# EAGLE design untitled (EAGLE 9.6.1)
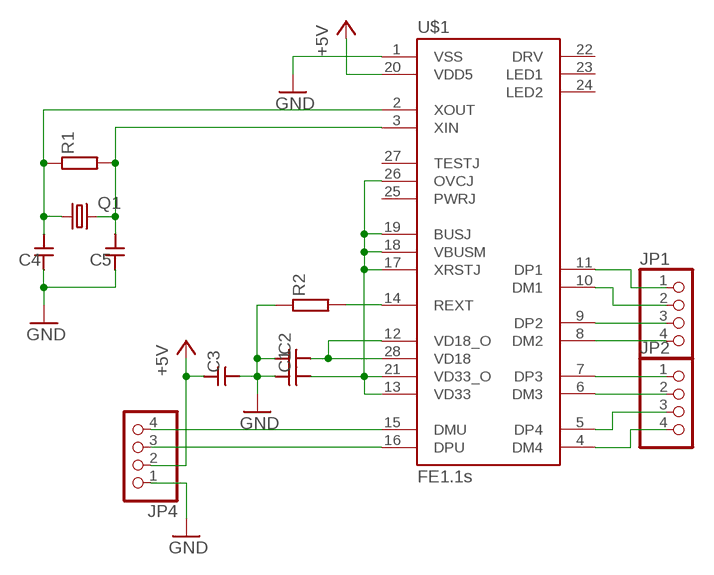
[diagram p0: schematic, sheet 1]

## Parts
C1  CAPACITOR1608  [SMD1608]
C2  CAPACITOR1608  [SMD1608]
C3  CAPACITOR1608  [SMD1608]
C4  CAPACITOR1608  [SMD1608]
C5  CAPACITOR1608  [SMD1608]
JP1  PINHD-1X4  [1X04]
JP2  PINHD-1X4  [1X04]
JP4  PINHD-1X4  [1X04]
Q1  CRYSTALHC49S  [HC49/S]
R1  RESISTOR1608  [SMD1608]
R2  RESISTOR1608  [SMD1608]
U$1  FE1.1S  [FE1.1S_SSOP-28]

## Nets
+5V: C3.1 JP4.2 U$1.20(VDD5)
GND: C1.1 C2.1 C3.2 C4.1 C5.1 JP4.1 R2.1 U$1.1(VSS)
N$1: JP4.4 U$1.15(DMU)
N$2: R2.2 U$1.14(REXT)
N$3: C2.2 U$1.12(VD18_O) U$1.28(VD18)
N$4: C4.2 Q1.1 R1.1 U$1.2(XOUT)
N$5: C1.2 U$1.13(VD33) U$1.17(XRSTJ) U$1.18(VBUSM) U$1.19(BUSJ) U$1.21(VD33_O) U$1.26(OVCJ)
N$6: C5.2 Q1.2 R1.2 U$1.3(XIN)
N$7: JP4.3 U$1.16(DPU)
N$10: JP1.4 U$1.8(DM2)
N$11: JP2.1 U$1.7(DP3)
N$12: JP2.2 U$1.6(DM3)
N$13: JP2.3 U$1.5(DP4)
N$14: JP2.4 U$1.4(DM4)
N$15: JP1.3 U$1.9(DP2)
N$16: JP1.2 U$1.10(DM1)
N$17: JP1.1 U$1.11(DP1)
Unconnected: U$1.22(DRV) U$1.23(LED1) U$1.24(LED2) U$1.25(PWRJ) U$1.27(TESTJ)

## Library data of the parts
C1-C5 = generic:CAPACITOR: Generic Capacitor
JP1 JP2 JP4 = pinhead:PINHD-1X4: PIN HEADER
Q1 = crystal:CRYSTAL: CRYSTAL; OC_FARNELL: 1667008; OC_NEWARK: unknown
R1 R2 = generic:RESISTOR: Generic Registor
U$1 = imcom:FE1.1S: A USB 2.0 hub IC. http://www.jfd-ic.com/Documents/FE1.1s%20Data%20Sheet%20%28Rev.%201.0%29.pdf

## Board
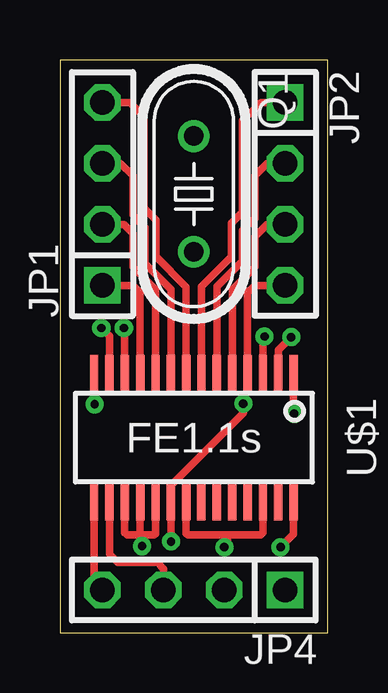
[diagram p1: board, top side]
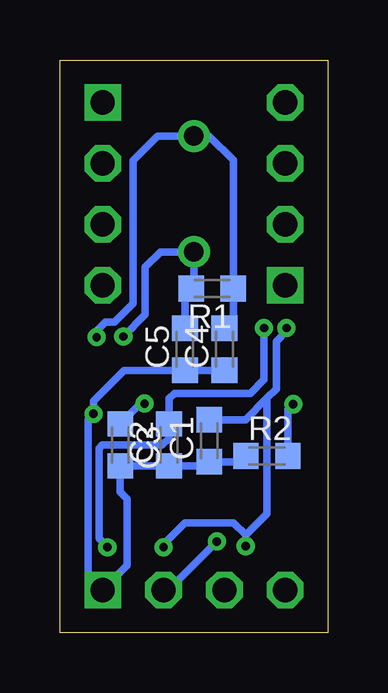
[diagram p2: board, bottom side, seen from below]

Size 11.18 x 23.88 mm. Coordinates in mm from the lower left corner, seen from the top.
Outline: 0,0 11.18,0 11.18,23.88 0,23.88 0,0
Copper layers (1*16): Top 0.035mm / dielectric 1.5mm / Bottom 0.035mm
Design rules "default": minimum track width 6mil, minimum drill 0.35mm, track to track 6mil, track to pad 6mil, pad to pad 6mil, via to via 6mil, smd to smd 6mil, copper to edge 40mil, drill to drill 6mil, minimum pad ring 10mil, minimum via ring 8mil, stop-mask expansion 4mil, vias tented up to drill 0mil, thermal gap 10mil

### Footprints (pad centres in the part's own frame; a part is rotated, then mirrored left to right if it is on the bottom)
SMD1608 = smd 1.05 x 1.08: 1 -0.875,0; 2 0.875,0
1X04 = drill 1.016 square: 1 -3.81,0 | drill 1.016 octagon: 2 -1.27,0; 3 1.27,0; 4 3.81,0
HC49/S = drill 0.813: 1 -2.413,0; 2 2.413,0
FE1.1S_SSOP-28 = smd 0.35 x 1.5: 1 -4.16,-2.7; 2 -3.52,-2.7; 3 -2.88,-2.7; 4 -2.24,-2.7; 5 -1.6,-2.7; 6 -0.96,-2.7; 7 -0.32,-2.7; 8 0.32,-2.7; 9 0.96,-2.7; 10 1.6,-2.7; 11 2.24,-2.7; 12 2.88,-2.7; 13 3.52,-2.7; 14 4.16,-2.7; 15 4.16,2.7; 16 3.52,2.7; 17 2.88,2.7; 18 2.24,2.7; 19 1.6,2.7; 20 0.96,2.7; 21 0.32,2.7; 22 -0.3,2.7; 23 -0.96,2.7; 24 -1.6,2.7; 25 -2.24,2.7; 26 -2.88,2.7; 27 -3.52,2.7; 28 -4.16,2.7

### Placement (x,y rotation side)
C1  4.95,8 90 bottom
C2  6.63,7.82 90 bottom
C3  8.66,7.82 270 bottom
C4  4.32,11.81 90 bottom
C5  5.97,11.81 90 bottom
JP1  1.78,18.29 90 top
JP2  9.4,18.29 270 top
JP4  5.59,1.78 180 top
Q1  5.59,18.29 270 top
R1  4.83,14.35 180 bottom
R2  2.54,7.37 0 bottom
U$1  5.59,8.13 180 top

### Tracks (layer width: path | path; a pad name or v marks a point on that pad's centre or on a via)
+5V  (via drill 0.35, 0.35 pad 0.65)
  Top 0.305: v4.64,3.8 4.63,3.8 U$1.20 4.63,6.14 7.65,9.16 v7.65,9.55
  Bottom 0.305: v4.64,3.8 6.65,1.78 JP4.2 | C3.1 7.81,9.55 v7.65,9.55
GND  (via drill 0.35)
  Top 0.305: U$1.1 9.75,9.15 v9.78,9.12
  Bottom 0.305: C4.1 C5.1 8.49,10.94 9.78,9.65 v9.78,9.12 10.01,8.88 10.01,2.39 JP4.1 8.38,2.79 8.38,5.58 8.66,5.86 C3.2 C2.1 5.13,6.95 C1.1 3.94,7.13 R2.1
N$1
  Top 0.305: U$1.15 1.43,2.13 JP4.4
N$2  (via drill 0.35)
  Top 0.305: U$1.14 1.45,10.81 v1.45,9.53
  Bottom 0.305: v1.45,9.53 1.67,9.31 R2.2
N$3  (via drill 0.35)
  Top 0.305: U$1.12 2.71,12.66 v2.67,12.7 | U$1.28 9.75,4.1 v9.2,3.56
  Bottom 0.305: v2.67,12.7 2.67,10.55 3.24,9.98 6.4,9.98 6.63,9.75 C2.2 6.63,8.1 6.91,7.82 9.41,7.82 9.56,7.68 9.56,3.92 v9.2,3.56
N$4  (via drill 0.35)
  Top 0.305: U$1.2 9.11,11.78 v9.65,12.32
  Bottom 0.305: v9.65,12.32 9.65,12.57 9.27,12.95 8.89,12.95 8.13,13.72 8.13,19.68 7.11,20.7 Q1.1 4.95,20.7 3.95,19.7 R1.1 3.95,13.05 C4.2
N$5  (via drill 0.35)
  Top 0.305: U$1.17 2.71,4.15 2.79,4.06 3.35,4.06 | U$1.26 8.47,4.15 8.38,4.06 6.99,4.06 | U$1.18 3.35,4.06 | U$1.13 2.07,12.36 v1.73,12.7 | U$1.19 3.99,4.12 3.94,4.06 3.35,4.06 | U$1.21 5.27,4.13 5.33,4.06 6.99,4.06 | 3.35,4.06 3.35,3.69 v3.43,3.6 | v6.86,3.56 6.99,3.68 6.99,4.06
  Bottom 0.305: v1.73,12.7 1.73,12.57 2.16,12.14 2.16,10.16 2.54,9.78 | C1.2 3.44,8.88 2.54,9.78 | v3.43,3.6 3.43,4.06 | v6.86,3.56 6.86,3.68 5.97,4.57 3.94,4.57 3.43,4.06 | 3.43,4.06 2.54,4.95 2.54,9.78
N$6  (via drill 0.35)
  Top 0.305: v8.53,12.34 8.47,12.28 U$1.3
  Bottom 0.305: v8.53,12.34 7.62,13.26 7.62,15.24 6.99,15.88 Q1.2 5.59,14.46 R1.2 5.96,14.1 5.96,12.7 C5.2
N$7
  Top 0.305: U$1.16 2.07,3.27 2.41,2.92 4.06,2.92 4.32,2.67 JP4.3
N$10
  Top 0.305: U$1.8 5.27,14.42 4.01,15.67 4.01,17.2 3.5,17.7 3.5,21.51 2.92,22.1 JP1.4
N$11
  Top 0.305: U$1.7 5.91,14.43 7.16,15.68 7.16,17.07 7.62,17.53 7.62,21.34 8.38,22.1 JP2.1
N$12
  Top 0.305: U$1.6 6.55,14.42 7.62,15.49 7.62,16.76 8.13,17.27 8.13,19.05 8.64,19.56 JP2.2
N$13
  Top 0.305: U$1.5 7.19,14.3 8.13,15.24 8.13,16.51 8.64,17.02 JP2.3
N$14
  Top 0.305: U$1.4 7.83,14.18 8.13,14.48 JP2.4
N$15
  Top 0.305: U$1.9 4.63,14.31 3.56,15.38 3.56,16.89 3.05,17.4 3.05,19.05 2.54,19.56 JP1.3
N$16
  Top 0.305: U$1.10 3.99,14.3 3.05,15.24 3.05,16.64 2.67,17.02 JP1.2
N$17
  Top 0.305: U$1.11 3.35,14.18 3.05,14.48 JP1.1